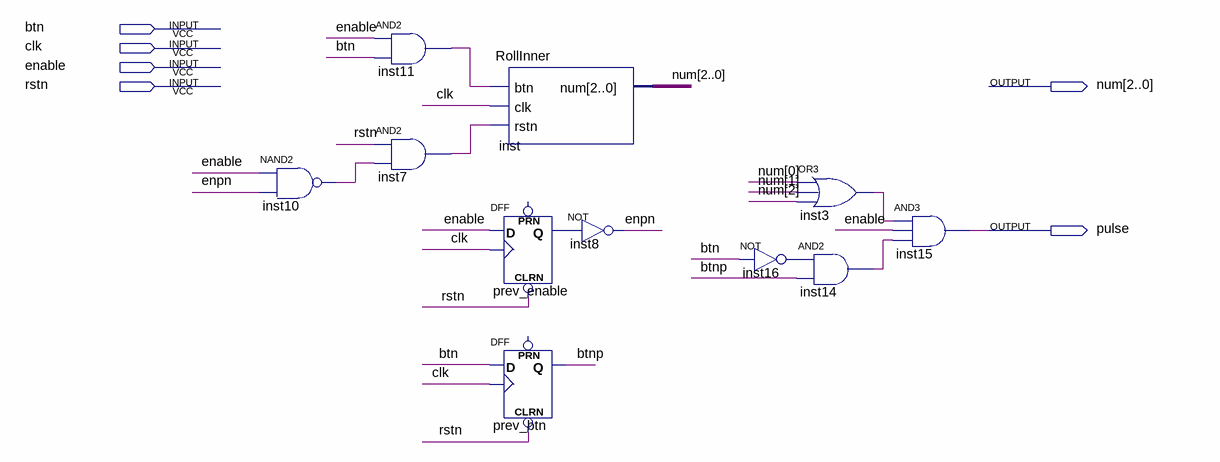
[diagram p0: schematic sheet]
// Quartus schematic Roll.bdf as structural Verilog: 11 symbols, 6 pins
module Roll (
  input  btn,
  input  clk,
  input  enable,
  input  rstn,
  output [2:0] num,
  output pulse
);

  wire btnp, enpn, inst3_out, inst7_out, inst10_out, inst11_out, inst14_out, inst16_out, prev_enable_q;

  nand inst10 (inst10_out, enable, enpn);
  and inst11 (inst11_out, enable, btn);
  and inst7 (inst7_out, rstn, inst10_out);
  RollInner inst (.btn(inst11_out), .clk(clk), .rstn(inst7_out), .num(num));
  DFF prev_enable (.CLRN(rstn), .CLK(clk), .D(enable), .Q(prev_enable_q));  // open: PRN
  DFF prev_btn (.CLRN(rstn), .CLK(clk), .D(btn), .Q(btnp));  // open: PRN
  not inst8 (enpn, prev_enable_q);
  not inst16 (inst16_out, btn);
  or inst3 (inst3_out, num[0], num[1], num[2]);
  and inst14 (inst14_out, inst16_out, btnp);
  and inst15 (pulse, inst3_out, enable, inst14_out);
endmodule
